# Altium schematic sheet 12V_REG.SchDoc
size A4; SheetNumber: 5; SheetTotal: 10
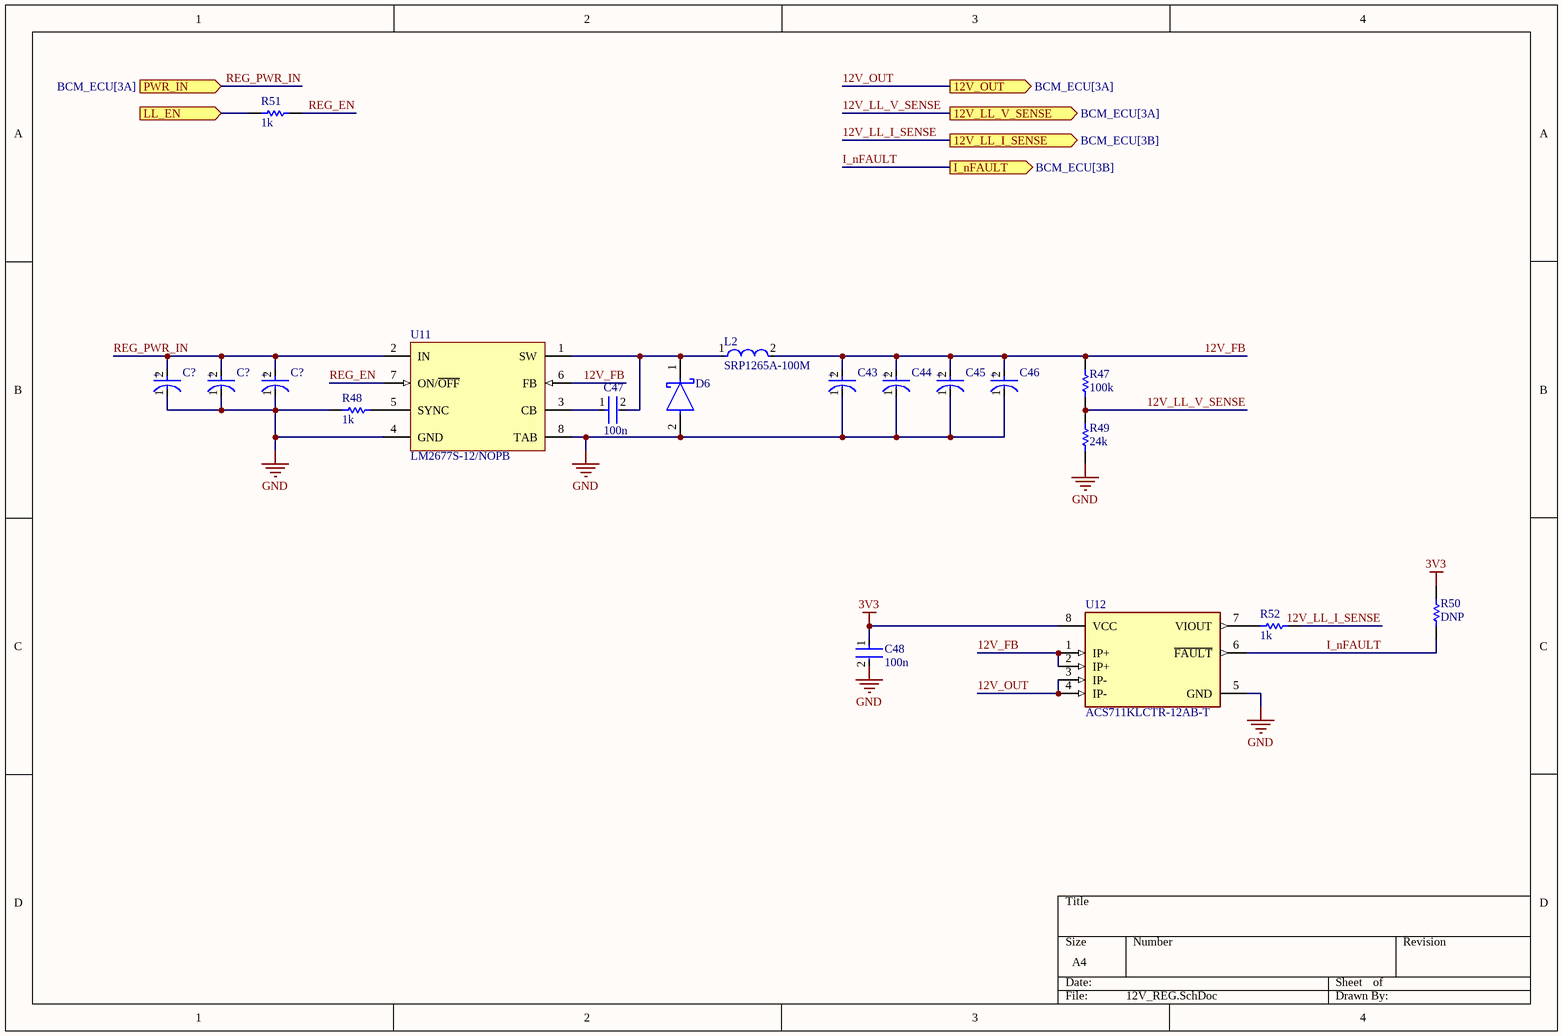
[diagram p0: 12V_REG.SchDoc]

## Parts
(Parts that share a designator on the sheet are numbered #1, #2 ... from top to bottom, then left to right.)
C43  T495D107K016ATE125  [FP-T495D107K016ATE125-MFG]  (value not drawn)
C44  T495D107K016ATE125  [FP-T495D107K016ATE125-MFG]  (value not drawn)
C45  T495D107K016ATE125  [FP-T495D107K016ATE125-MFG]  (value not drawn)
C46  T495D107K016ATE125  [FP-T495D107K016ATE125-MFG]  (value not drawn)
C47  100n  [FP-0402-L_1_0_0_05-W_0_5-IPC_A]
C48  100n  [FP-0402-L_1_0_0_05-W_0_5-IPC_A]
C?#1  50SVPF68M  [FP-OS-CON-SMT-F12-MFG]  (value not drawn)
C?#2  50SVPF68M  [FP-OS-CON-SMT-F12-MFG]  (value not drawn)
C?#3  50SVPF68M  [FP-OS-CON-SMT-F12-MFG]  (value not drawn)
D6  B540C-13-F  [FP-SMC-MFG]  (value not drawn)
L2  SRP1265A-100M  [FP-SRP1265A-100M-MFG]
R47  100k  [R0603B]
R48  1k  [R0603B]
R49  24k  [R0603B]
R50  DNP  [R0603B]
R51  1k  [R0603B]
R52  1k  [R0603B]
U11  LM2677S-12/NOPB  [KTW0007B_M]
U12  ACS711KLCTR-12AB-T  [FP-LC-8-IPC_C]

## Ports
12V_LL_I_SENSE (out, see BCM_ECU[3B]), 12V_LL_V_SENSE (out, see BCM_ECU[3A]), 12V_OUT (out, see BCM_ECU[3A]), I_nFAULT (out, see BCM_ECU[3B]), LL_EN (in), PWR_IN (in, see BCM_ECU[3A])

## Nets
3V3: C48.1 R50.1 U12.8(VCC)
GND: C43.1(C) C44.1(C) C45.1(C) C46.1(C) C48.2 C?#1.1(C) C?#2.1(C) C?#3.1(C) D6.2(A) R48.2 R49.2 U11.4(GND) U11.8(TAB) U12.5(GND)
12V_FB: C43.2(A) C44.2(A) C45.2(A) C46.2(A) L2.2 R47.1 U11.6(FB) U12.1(IP+) U12.2(IP+)
12V_LL_I_SENSE: R52.1 ; port 12V_LL_I_SENSE
12V_LL_V_SENSE: R47.2 R49.1 ; port 12V_LL_V_SENSE
12V_OUT: U12.3(IP-) U12.4(IP-) ; port 12V_OUT
I_nFAULT: R50.2 U12.6(~{FAULT}) ; port I_nFAULT
LL_EN: R51.2 ; port LL_EN
REG_EN: R51.1 U11.7(ON/~{OFF})
REG_PWR_IN: C?#1.2(A) C?#2.2(A) C?#3.2(A) U11.2(IN) ; port PWR_IN
NetC47_1: C47.1 U11.3(CB)
NetC47_2: C47.2 D6.1(C) L2.1 U11.1(SW)
NetR48_1: R48.1 U11.5(SYNC)
NetR52_2: R52.2 U12.7(VIOUT)

## Notes on the sheet
- (in symbol CMP-2000-07207-2) +
- (in symbol CMP-05428-000631-1) +

## Library data of the parts
C43-C46 = CMP-2000-07207-2: CAP TANT 100UF 10% 16V 2917; Life (Hours): 2000Hour; ESR (Equivalent Series Resistance): 125mR; Polarity: Polar; Dielectric Material: Tantalum; Dissipation Factor: 8%; Capacitance: 100uF; Radiation Hardening: No; RoHS Compliant: Yes; Length: 7.3mm; Features: General Purpose; Packaging: Tape and Reel; Package Quantity: 1; Weight: 0.023634oz; Voltage Rating: 16V; Width: 0.169inch; Case/Package: 2917; Mount: Surface Mount; Voltage: 16V; Min Operating Temperature: -55°C; Tolerance: 10%; REACH SVHC: No SVHC; Height - Seated (Max): 0.122inch; Number of Pins: 2; Construction: Flat; Depth: 4.3mm; Series: T495; Max Operating Temperature: 125°C; Failure Rate: 0.001%; Termination: SMD/SMT; Voltage Rating (DC): 16V; Case Code (Imperial): 2917; Case Code (Metric): 7343; Height: 2.8mm
C47 C48 = CMP-001-00058-1: LARGE PADS, 0402 CAP, CHANGE COMMENT TO MATCH REAL P/N; Capacitor Type: Ceramic; Min Operating Temperature: -55°C; Mounting Technology: Surface Mount; Pins: 2; Case/Package: 0402; RoHS Compliant: Yes; Max Operating Temperature: 85°C
C?#1-C?#3 = CMP-05428-000631-1: Conductive Polymer Aluminum Solid Capacitors (OS-CON) 68uF ±20% 50V RADIAL SMT 10x12.6mm; Leakage Current: 680uA; Life (Hours): 5000Hour; Dissipation Factor: 12%; Ripple Current (AC): 4.3A; ESR (Equivalent Series Resistance): 20mR; Polarity: Polar; Diameter: 10mm; Capacitance: 68uF; Min Operating Temperature: -55°C; Construction: Cylindrical; Tolerance: 20%; Voltage Rating: 50V; Case/Package: Radial; Mount: Surface Mount; Max Operating Temperature: 105°C; RoHS Compliant: Yes; Height - Seated (Max): 0.5inch; Termination: SMD/SMT; Voltage Rating (DC): 50V; Packaging: Tape and Reel; Length: 12.6mm; Package Quantity: 400; Number of Pins: 12; Lead Free: Lead Free; Height: 12.6mm; REACH SVHC: No SVHC; Ripple Current: 4.3A; Series: OS-CON™, SVPF; Voltage: 50V
D6 = CMP-2000-05097-3: DIODE SCHOTTKY 40V 5A SMC; Manufacturer: Diodes Inc.; Automotive Grade: NA; Peak Reverse Current: 0.5mA; Value: 300pF; Max Junction Temp: +150°C; Max Surge Forward Current: 100A; Standoff Height: 0.1mm; Digikey Description: DIODE SCHOTTKY 40V 5A SMC; Temperature Range Low: -55°C; Manufacturer Part Number: B540C-13-F; Octopart: https://octopart.com/b540c-13-f-diodes+inc.-325873; Lead Free: Yes; Reverse Voltage: 40V; RoHS: TRUE; Category: Diode; Mouser Description: Diode: Schottky rectifying; SMD; 40V; 5A; SMC; Package: reel, tape; ComponentLink2Description: Datasheet; Temperature Range High: +150°C; Automotive: No; Footprint Url: https://www.diodes.com/assets/Package-Files/SMC.pdf; Device Class L3: Schottky Diodes; Height: 2.5mm; Forward Current: 5A; Temperature: -55°C to +150°C; Package: SMC; ComponentLink2URL: https://www.diodes.com/assets/Datasheets/ds13012.pdf; Device Class L2: Diodes; Max Repetitive Reverse Voltage: 40V; Device Class L1: Discrete Semiconductors; Capacitance: 300pF
L2 = CMP-07248-000069-1: FIXED IND 10UH 10A 16.5 MOHM SMD; Shielding: Shielded; Self Resonant Frequency: 10MHz; Test Frequency: 100kHz; Q Factor: 20; Saturation Current: 15.5A; Tolerance: 20%; Core Material: Carbonyl Powder; DC Resistance (DCR): 16.5mR; REACH SVHC: No SVHC; Case/Package: Nonstandard; Length: 13.5mm; RMS Current (Irms): 10A; Termination: SMD/SMT; Max DC Current: 10A; Ratings: AEC-Q200; Max Operating Temperature: 150°C; Height: 6.2mm; Resistor Type: Wirewound; Min Operating Temperature: -40°C; Mount: Surface Mount; Packaging: Cut Tape; Depth: 12.5mm; Package Quantity: 500; RoHS Compliant: Yes; Current Rating: 10A; Inductance Tolerance: 20%; Width: 0.492inch; Height - Seated (Max): 0.252inch; Inductance: 10uH
R47 R50 = CMP-009-00002-14: Resistor; Value: 10k
R48 R51 R52 = CMP-009-00002-14: Resistor; Value: 1k
R49 = CMP-009-00002-14: Resistor; Value: 2.7k
U11 = CMP-0069-00198-3: SIMPLE SWITCHER® High Efficiency 5A Step-Down Voltage Regulator with Sync, 7-pin TO-263, Pb-Free; Manufacturer: Texas Instruments; PowerWise: N; PackageTopMarking: NSUZXYTTE#*LM2677S*-12; ComponentLink1URL: http://www.ti.com/general/docs/lit/getliterature.tsp?genericPartNumber=LM2677&fileType=pdf; Code_JEDEC: MO-169-AC; CompType: Switcher; ComponentLink1Description: Datasheet URL; PackageDescription: TO-263, Molded, .400 x .390 x .180in Body, 7 Lead, .050in Pitch, Surface Mount; PackageReference: KTW0007B; RoHS: Y; PinCount: 7
U12 = CMP-1557-00012-2: SENSOR CURRENT HALL 12.5A AC/DC; Number of Channels: 1; Min Supply Voltage: 3V; Sensitivity: 110mV/A; Response Time: 4.6us; Operating Supply Voltage: 3.3V; Max Supply Voltage: 5.5V; Max Supply Current: 5.5mA; Bandwidth: 100kHz; Linearity: 1%; Quiescent Current: 4mA; Accuracy: 5%; Polarity: Bidirectional; Case/Package: SOIC; Packaging: Tape and Reel; Number of Pins: 8; Width: 3.9mm; Frequency: 100kHz; -3db Bandwidth: 100kHz; REACH SVHC: No SVHC; Series: -; Height: 1.5mm; Package Quantity: 1; Min Operating Temperature: -40°C; Max Operating Temperature: 125°C; Current Sensing: 12.5A; RoHS Compliant: Yes; Length: 4.9mm